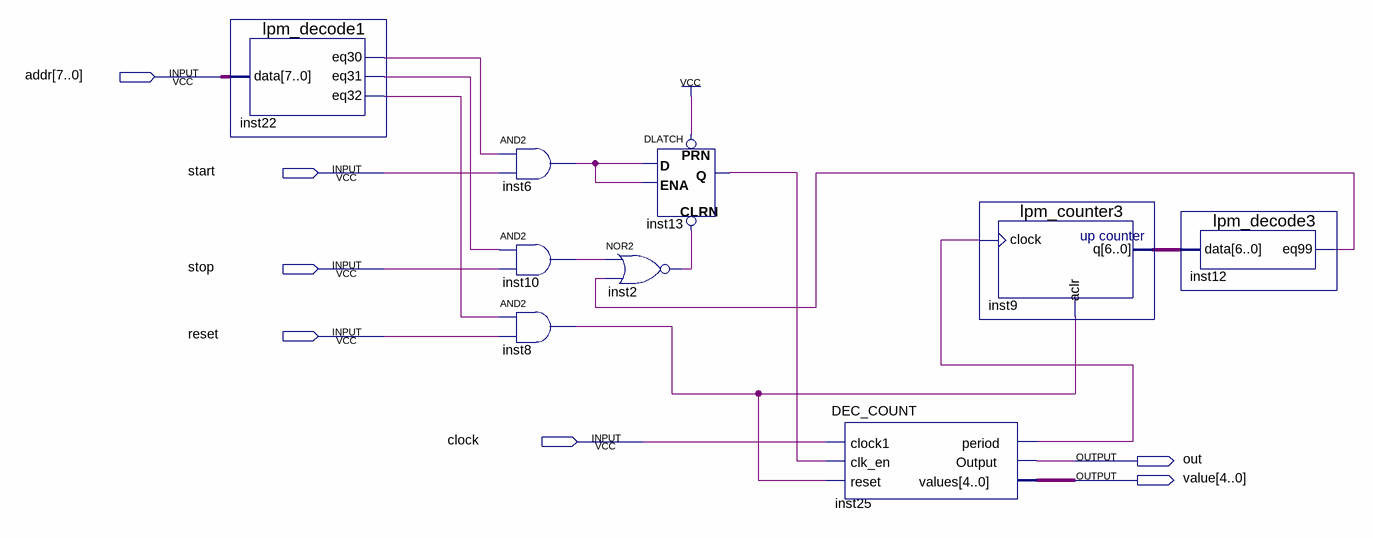
[diagram p0: schematic sheet]
// Quartus schematic interface.bdf as structural Verilog: 9 symbols, 7 pins
module \interface  (
  input  [7:0] addr,
  input  start,
  input  stop,
  input  reset,
  input  clock,
  output out,
  output [4:0] value
);

  wire inst2_out, inst6_out, inst8_out, inst10_out, inst12_eq99, inst13_q, inst22_eq30, inst22_eq31,
       inst22_eq32, inst25_period;
  wire [6:0] inst9_q;

  lpm_decode1 inst22 (.data(addr), .eq30(inst22_eq30), .eq31(inst22_eq31), .eq32(inst22_eq32));
  and inst6 (inst6_out, inst22_eq30, start);
  and inst10 (inst10_out, inst22_eq31, stop);
  and inst8 (inst8_out, inst22_eq32, reset);
  DLATCH inst13 (.CLRN(inst2_out), .D(inst6_out), .ENA(inst6_out), .PRN(1'b1), .Q(inst13_q));
  nor inst2 (inst2_out, inst10_out, inst12_eq99);
  DEC_COUNT inst25 (
    .clock1(clock), .clk_en(inst13_q), .reset(inst8_out), .period(inst25_period), .Output(out), .values(value));
  lpm_counter3 inst9 (.clock(inst25_period), .aclr(inst8_out), .q(inst9_q));
  lpm_decode3 inst12 (.data(inst9_q), .eq99(inst12_eq99));
endmodule
